# Altium schematic sheet Power.SchDoc
size A4; SheetNumber: 4; SheetTotal: 4
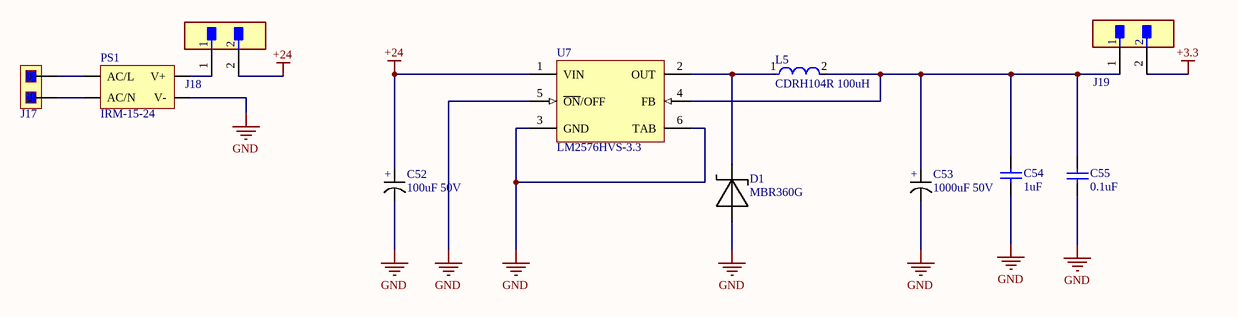
[diagram p0: Power.SchDoc]

## Parts
C52  100uF 50V  [CAP VT 100uF 50V]
C53  1000uF 50V  [CAP: dip 1000uF 50V]
C54  1uF  [CAPC2013X135X45ML10T25]
C55  0.1uF  [CAPC2013X135X45ML10T25]
D1  MBR360G  [MBR360G]
J17  KF301  [KF301-2P]  (value not drawn)
J18  M22-2510205  [FP-M22-2510205-MFG]  (value not drawn)
J19  M22-2510205  [FP-M22-2510205-MFG]  (value not drawn)
L5  CDRH104R 100uH  [FP-CDRH104R-MFG]
PS1  IRM-15-24  [IRM 15-24]
U7  LM2576HVS-3.3  [KTT0005B_L]

## Nets
+3.3: J19.2
+24: C52.1(+) J18.2 U7.1(VIN)
GND: C52.2(-) C53.2(-) C54.1 C55.1 D1.1 PS1.3(V-) U7.3(GND) U7.5(~{ON}/OFF) U7.6(TAB)
NetC53_1: C53.1(+) C54.2 C55.2 J19.1 L5.2 U7.4(FB)
NetD1_2: D1.2 L5.1 U7.2(OUT)
NetJ17_1: J17.1 PS1.1(AC/L)
NetJ17_2: J17.2 PS1.2(AC/N)
NetJ18_1: J18.1 PS1.4(V+)

## Library data of the parts
C52 = Cap: VT 100uF 50V: Capacitance: 100uF; Voltage Rating (DC): 50V
C53 = Cap: 1000uF 50V: Capacitance: 1000uF; Voltage Rating (DC): 50V
C54 C55 = CMP-2007-03607-1: Manufacturer: Murata; Part Number: GRM21BR72E103KW03L
  C54: Capacitance: 1uF
  C55: Capacitance: 0.1uF
D1 = MBR360G: Rectifier Diode, Schottky, 1 Phase, 1 Element, 3A, 60V V(RRM), Silicon, DO-201AD; Manufacturer: onsemi; Color: Green; Max Reverse Current: 600uA; Max Surge Current: 80A; Element Configuration: Single; Polarity: Standard; Lens Style: Diffused; Luminous Intensity: 15mcd; Power Rating: 52mW; Supplier: Avnet; Supplier Part Number: MBR360G; Manufacturer Part Number: MBR360G; RoHS: Yes; Category: Schottky Diodes; Stock: 279; Pricing: 500=0,16169, 510=0,15835, 1100=0,15514, 2500=0,15105, 5000=0,14813 (USD); Case/Package: DO-201AD; Pins: 2; Case Code (Imperial): 0603; Case Code (Metric): 1608; Min Operating Temperature: -65°C; Max Operating Temperature: 150°C; Forward Current: 3A; Package Quantity: 500; Packaging: Bulk; Max Reverse Leakage Current: 600uA; Average Rectified Current: 3A; Max Repetitive Reverse Voltage (Vrrm): 60V; Peak Non-Repetitive Surge Current: 80A; Max Forward Surge Current (Ifsm): 80A; Voltage Rating (DC): 60V; Current Rating: 3A; Output Current: 3A; Max Reverse Voltage (DC): 60V; Series: -; Illumination Color: Green; Breakdown Voltage: 60V; Diameter: 5.3mm; Length: 0.374inch; Width: 5.3mm; Height: 5.3mm; Radiation Hardening: No; Reach SVHC Compliant: No; Lead Free: Lead Free; Halogen Free: Halogen Free; RoHS Compliant: Yes; ComponentLink1URL: https://datasheet.ciiva.com/915/mbr350-d-915938.pdf?src-supplier=Avnet; ComponentLink1Description: https://datasheet.ciiva.com/915/mbr350-d-915938.pdf?src-supplier=Avnet; ComponentLink2URL: https://datasheet.ciiva.com/27050/886711-27050614.pdf?src-supplier=Jameco; ComponentLink2Description: https://datasheet.ciiva.com/27050/886711-27050614.pdf?src-supplier=Jameco; ComponentLink3URL: https://datasheet.ciiva.com/7962/85926-7962998.pdf?src-supplier=Element14; ComponentLink3Description: https://datasheet.ciiva.com/7962/85926-7962998.pdf?src-supplier=Element14; ComponentLink4URL: https://datasheet.ciiva.com/14560/70099825-14560826.pdf?src-supplier=Allied+Electronics; ComponentLink4Description: https://datasheet.ciiva.com/14560/70099825-14560826.pdf?src-supplier=Allied+Electronics
J17 = KF301-5.0-2P
J18 J19 = CMP-15831-000005-1: CONN HEADER VERT 2POS 2MM; Manufacturer: Harwin; Conn Gender: Male; Current Rating: 2A; Number Of Contacts: 2; Conn Orientation: Vertical; Temperature Range Low: -40°C; Device Class L1: Connectors; ComponentLink2URL: https://cdn.harwin.com/pdfs/C018XX_M22_Series_Connectors.pdf; Temperature Range High: +105°C; Pitch: 2mm; Number Of Rows: 1; Temperature: -40°C to +105°C; Automotive: No; Device Class L3: unset; Octopart: https://octopart.com/m22-2510205-harwin-2538221; Mouser Description: Headers & Wire Housings 2 PIN SIL VERTICAL GOLD PIN HEADER; Height: 5.45mm; Category: Conn; Digikey Description: CONN HEADER VERT 2POS 2MM; Contact Material: Gold,Nickel; Lead Free: Yes; ComponentLink2Description: Datasheet; Manufacturer Part Number: M22-2510205; Device Class L2: Headers and Wire Housings; Package: 0; Footprint Url: https://cdn.harwin.com/pdfs/M22-251.pdf; RoHS: TRUE
L5 = CMP-48855-000006-1: FIXED IND 5.2UH 6A 22 MOHM SMD; Core Material: Ferrite; Max DC Current: 5.4A; Rated Current-Max: 5.5A; Test Frequency: 100kHz; Saturation Current: 5.6A; Tolerance: 30%; DC Resistance (DCR): 22mR; Shielding: Shielded; Depth: 10.3mm; Lead Free: Lead Free; Series: CDRH; Min Operating Temperature: -40°C; Mount: Surface Mount; Max Operating Temperature: 100°C; Termination: SMD/SMT; Width: 0.394inch; Radiation Hardening: No; Package Quantity: 1; Height: 4mm; Height - Seated (Max): 0.157inch; Military Standard: Not; Inductance: 100uH; Length: 10.5mm; Packaging: Tape and Reel; DC Current: 5.4A; Case/Package: Nonstandard; Current Rating: 5.4A
PS1 = IRM-15-24: AC to DC Power Supply Encapsulated Single Output 24 Volts 0.63 Amps 15.12 Watts; Manufacturer: Mean Well; Supplier: Arrow Electronics; Supplier Part Number: IRM-15-24; Manufacturer Part Number: IRM-15-24; RoHS: Yes; Category: Board Mount Modules; Stock: 2118; Pricing: 1=8,6, 5=8,24 (USD); ComponentLink1URL: https://datasheet.ciiva.com/48990/70387824-48990022.pdf?src-supplier=Allied+Electronics; ComponentLink1Description: https://datasheet.ciiva.com/48990/70387824-48990022.pdf?src-supplier=Allied+Electronics; ComponentLink2URL: https://datasheet.ciiva.com/30199/910irm-15-spec-30199847.pdf?src-supplier=Onlinecomponents.com; ComponentLink2Description: https://datasheet.ciiva.com/30199/910irm-15-spec-30199847.pdf?src-supplier=Onlinecomponents.com
U7 = CMP-0069-00094-3: SIMPLE SWITCHER® 1A Step-Down Voltage Regulator, 5-pin TO-263, Pb-Free; Manufacturer: Texas Instruments; PackageTopMarking: NSUZXYTTE#*LM2575HVS*-12 P+; PowerWise: N; CompType: Switcher; PinCount: 5; Code_JEDEC: MO-169-AB; PackageReference: KTT0005B; PackageDescription: TO-263, Molded, .400 x .390 x .180in, 5 Lead, .067in Pitch, Surface Mount; RoHS: Y; ComponentLink1Description: Datasheet URL; ComponentLink1URL: http://www.ti.com/general/docs/lit/getliterature.tsp?genericPartNumber=LM2575HV&fileType=pdf